# EAGLE design LEDDisplays-v00 (EAGLE 6.3)
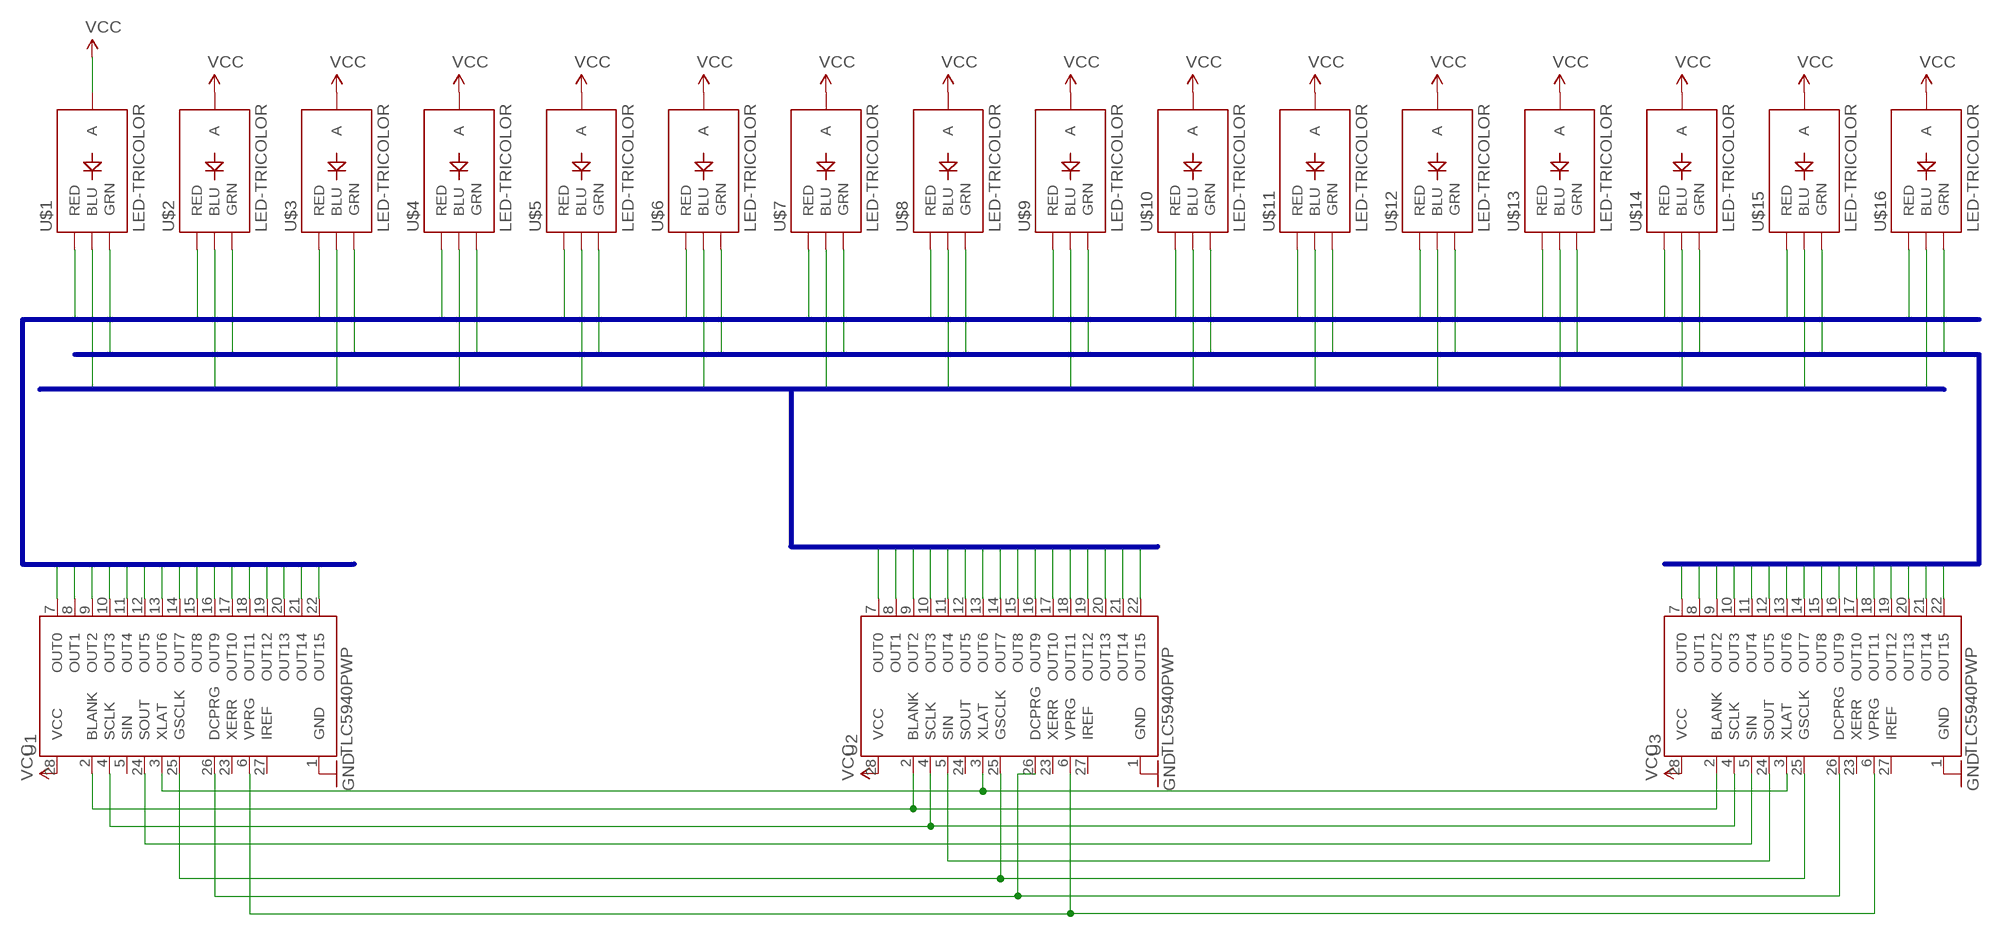
[diagram p0: schematic, sheet 1]

## Parts
U1  TLC5940PWP  [TSSOP28-GROUNDPAD]
U2  TLC5940PWP  [TSSOP28-GROUNDPAD]
U3  TLC5940PWP  [TSSOP28-GROUNDPAD]
U$1  LED-TRICOLOR  [LED-TRICOLOR-SMD]
U$2  LED-TRICOLOR  [LED-TRICOLOR-SMD]
U$3  LED-TRICOLOR  [LED-TRICOLOR-SMD]
U$4  LED-TRICOLOR  [LED-TRICOLOR-SMD]
U$5  LED-TRICOLOR  [LED-TRICOLOR-SMD]
U$6  LED-TRICOLOR  [LED-TRICOLOR-SMD]
U$7  LED-TRICOLOR  [LED-TRICOLOR-SMD]
U$8  LED-TRICOLOR  [LED-TRICOLOR-SMD]
U$9  LED-TRICOLOR  [LED-TRICOLOR-SMD]
U$10  LED-TRICOLOR  [LED-TRICOLOR-SMD]
U$11  LED-TRICOLOR  [LED-TRICOLOR-SMD]
U$12  LED-TRICOLOR  [LED-TRICOLOR-SMD]
U$13  LED-TRICOLOR  [LED-TRICOLOR-SMD]
U$14  LED-TRICOLOR  [LED-TRICOLOR-SMD]
U$15  LED-TRICOLOR  [LED-TRICOLOR-SMD]
U$16  LED-TRICOLOR  [LED-TRICOLOR-SMD]

## Nets
B1: U2.7(OUT0) U$1.B(BLU)
B2: U2.8(OUT1) U$2.B(BLU)
B3: U2.9(OUT2) U$3.B(BLU)
B4: U2.10(OUT3) U$4.B(BLU)
B5: U2.11(OUT4) U$5.B(BLU)
B6: U2.12(OUT5) U$6.B(BLU)
B7: U2.13(OUT6) U$7.B(BLU)
B8: U2.14(OUT7) U$8.B(BLU)
B9: U2.15(OUT8) U$9.B(BLU)
B10: U2.16(OUT9) U$10.B(BLU)
B11: U2.17(OUT10) U$11.B(BLU)
B12: U2.18(OUT11) U$12.B(BLU)
B13: U2.19(OUT12) U$13.B(BLU)
B14: U2.20(OUT13) U$14.B(BLU)
B15: U2.21(OUT14) U$15.B(BLU)
B16: U2.22(OUT15) U$16.B(BLU)
BLANK: U1.2(BLANK) U2.2(BLANK) U3.2(BLANK)
DCPRG: U1.26(DCPRG) U2.26(DCPRG) U3.26(DCPRG)
G1: U3.7(OUT0) U$1.G(GRN)
G2: U3.8(OUT1) U$2.G(GRN)
G3: U3.9(OUT2) U$3.G(GRN)
G4: U3.10(OUT3) U$4.G(GRN)
G5: U3.11(OUT4) U$5.G(GRN)
G6: U3.12(OUT5) U$6.G(GRN)
G7: U3.13(OUT6) U$7.G(GRN)
G8: U3.14(OUT7) U$8.G(GRN)
G9: U3.15(OUT8) U$9.G(GRN)
G10: U3.16(OUT9) U$10.G(GRN)
G11: U3.17(OUT10) U$11.G(GRN)
G12: U3.18(OUT11) U$12.G(GRN)
G13: U3.19(OUT12) U$13.G(GRN)
G14: U3.20(OUT13) U$14.G(GRN)
G15: U3.21(OUT14) U$15.G(GRN)
G16: U3.22(OUT15) U$16.G(GRN)
GND: U1.1(GND) U2.1(GND) U3.1(GND)
GSCLK: U1.25(GSCLK) U2.25(GSCLK) U3.25(GSCLK)
N$1: U1.24(SOUT) U3.5(SIN)
N$2: U2.5(SIN) U3.24(SOUT)
R1: U1.7(OUT0) U$1.R(RED)
R2: U1.8(OUT1) U$2.R(RED)
R3: U1.9(OUT2) U$3.R(RED)
R4: U1.10(OUT3) U$4.R(RED)
R5: U1.11(OUT4) U$5.R(RED)
R6: U1.12(OUT5) U$6.R(RED)
R7: U1.13(OUT6) U$7.R(RED)
R8: U1.14(OUT7) U$8.R(RED)
R9: U1.15(OUT8) U$9.R(RED)
R10: U1.16(OUT9) U$10.R(RED)
R11: U1.17(OUT10) U$11.R(RED)
R12: U1.18(OUT11) U$12.R(RED)
R13: U1.19(OUT12) U$13.R(RED)
R14: U1.20(OUT13) U$14.R(RED)
R15: U1.21(OUT14) U$15.R(RED)
R16: U1.22(OUT15) U$16.R(RED)
SCLK: U1.4(SCLK) U2.4(SCLK) U3.4(SCLK)
VCC [VCC]: U1.28(VCC) U2.28(VCC) U3.28(VCC) U$1.A U$2.A U$3.A U$4.A U$5.A U$6.A U$7.A U$8.A U$9.A U$10.A U$11.A U$12.A U$13.A U$14.A U$15.A U$16.A
VPRG: U1.6(VPRG) U2.6(VPRG) U3.6(VPRG)
XLAT: U1.3(XLAT) U2.3(XLAT) U3.3(XLAT)
Unconnected: U1.5(SIN) U1.23(XERR) U1.27(IREF) U2.23(XERR) U2.24(SOUT) U2.27(IREF) U3.23(XERR) U3.27(IREF)

## Buses
R[1..16]
G[1..16]
B[1..16]

## Library data of the parts
U1-U3 = SparkFun-DigitalIC:TLC5940: 16-channel LED Driver with Dot Correction and Grayscale PWM Control The TLC5940 is a 16-channel, constant-current sink LED driver. Each channel has an individually adjustable 4096-step grayscale PWM brightness control and a 64-step, constant-current sink (dot correction). The dot correction adjusts the brightness variations between LED channels and other LED drivers. The dot correction data is stored in an integrated EEPROM. Both grayscale control and dot correction are accessible via a serial interface. A single external resistor sets the maximum current value of all 16 channels. Packages: 28-pin HTSSOP 32-pin 5x5mm QFN 28-pin DIP
U$1-U$16 = SparkFun-LED:LED-TRICOLOR: Tri-Color LED SMD Proven layout and schematic for triple color LED in SMD package - common anode. Spark Fun Electronics SKU : COM-07844

## Net classes
0 default: width 0.152 mm
1 VCC: width 0.254 mm

## Board
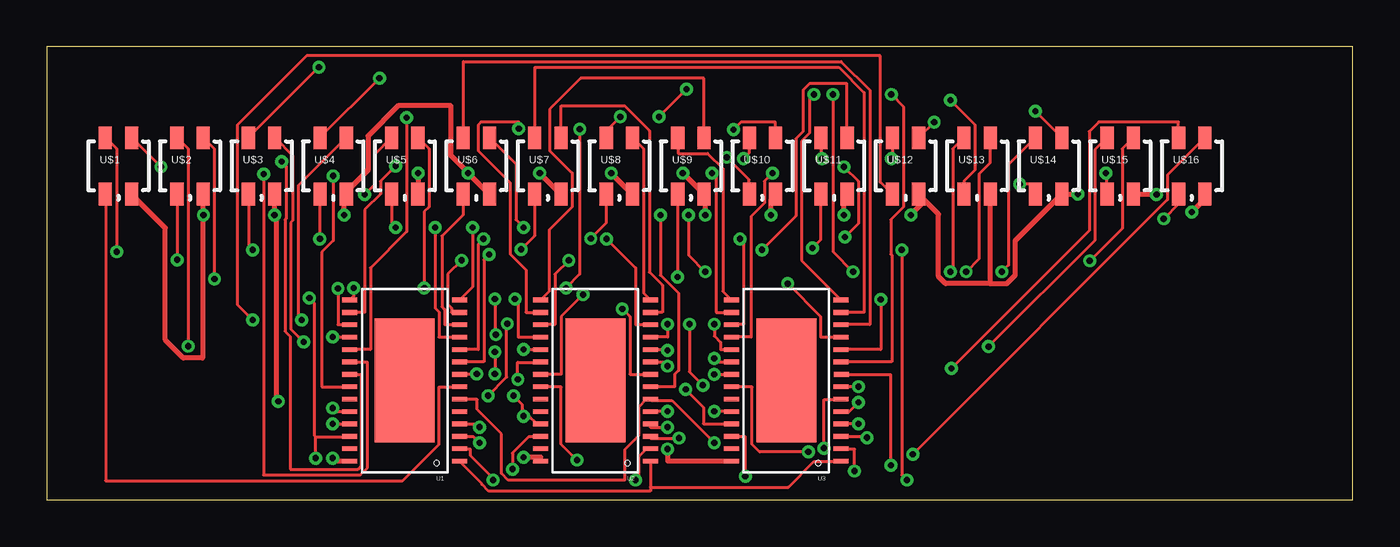
[diagram p1: board, top side]
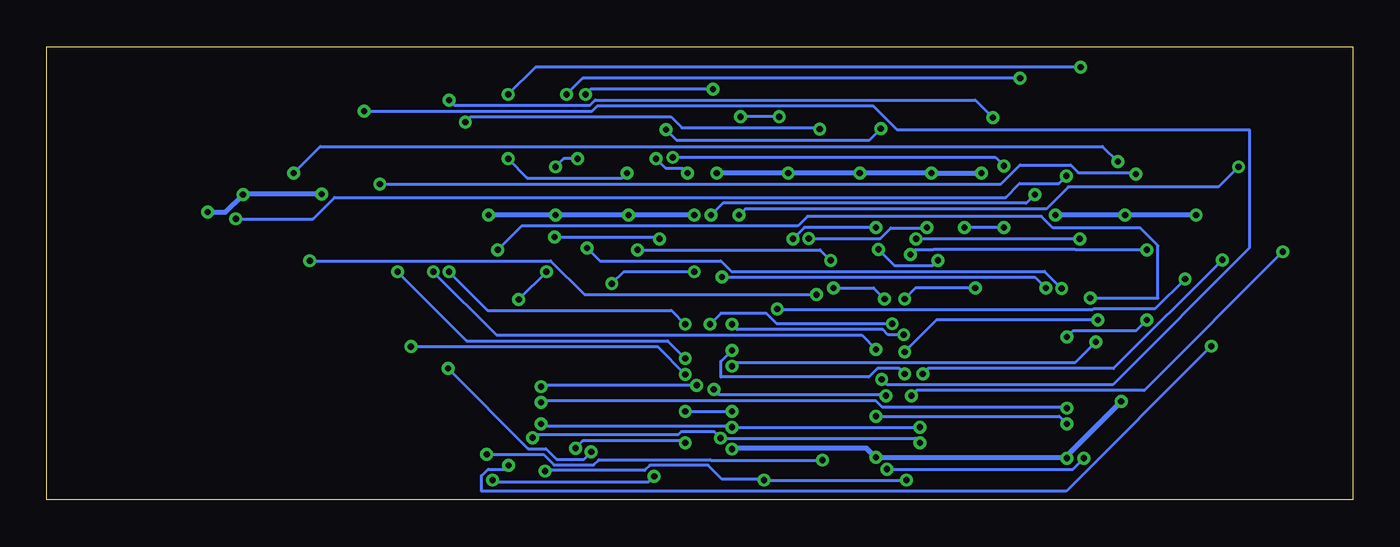
[diagram p2: board, bottom side, seen from below]

Size 69.52 x 24.12 mm. Coordinates in mm from the lower left corner, seen from the top.
Outline: 0,0 69.52,0 69.52,24.12 0,24.12 0,0
Copper layers (1*16): Top 0.0356mm / dielectric 1.5011mm / Bottom 0.0356mm
Design rules "LaenPCBOrder-JCModified": minimum track width 6mil, minimum drill 13mil, track to track 6mil, track to pad 6mil, pad to pad 6mil, via to via 6mil, smd to smd 6mil, copper to edge 15mil, drill to drill 6mil, minimum pad ring 12mil, minimum via ring 7mil, stop-mask expansion 4mil, vias tented up to drill 25mil, thermal gap 10mil

### Footprints (pad centres in the part's own frame; a part is rotated, then mirrored left to right if it is on the bottom)
TSSOP28-GROUNDPAD = smd 0.8 x 0.25: 1 -2.921,4.298; 2 -2.921,3.637; 3 -2.921,2.977; 4 -2.921,2.317; 5 -2.921,1.656; 6 -2.921,0.996; 7 -2.921,0.335; 8 -2.927,-0.325; 9 -2.921,-0.985; 10 -2.921,-1.646; 11 -2.921,-2.306; 12 -2.921,-2.967; 13 -2.921,-3.627; 14 -2.921,-4.287; 15 2.921,-4.287; 16 2.921,-3.627; 17 2.921,-2.967; 18 2.921,-2.306; 19 2.921,-1.646; 20 2.921,-0.985; 21 2.927,-0.325; 22 2.921,0.335; 23 2.921,0.996; 24 2.921,1.656; 25 2.921,2.317; 26 2.921,2.977; 27 2.921,3.637; 28 2.921,4.298 | smd 3.2 x 6.6: 29 0,0.005
LED-TRICOLOR-SMD = smd 0.7 x 1.2: A 0.7,-1.5; B 0.7,1.5; G -0.7,1.5; R -0.7,-1.5

### Placement (x,y rotation side)
U1  19.05,6.35 180 top
U2  29.21,6.35 180 top
U3  39.37,6.35 180 top
U$1  3.81,17.78 0 top
U$2  7.62,17.78 0 top
U$3  11.43,17.78 0 top
U$4  15.24,17.78 0 top
U$5  19.05,17.78 0 top
U$6  22.86,17.78 0 top
U$7  26.67,17.78 0 top
U$8  30.48,17.78 0 top
U$9  34.29,17.78 0 top
U$10  38.1,17.78 0 top
U$11  41.91,17.78 0 top
U$12  45.72,17.78 0 top
U$13  49.53,17.78 0 top
U$14  53.34,17.78 0 top
U$15  57.15,17.78 0 top
U$16  60.96,17.78 0 top

### Tracks (layer width: path | path; a pad name or v marks a point on that pad's centre or on a via)
B1  (via drill 0.33)
  Top 0.152: v32.66,15.16 32.66,11.96 33.63,11 33.63,6.88 33.43,6.68 33.43,6.02 U2.7 | v6.07,17.73 U$1.B
  Bottom 0.152: v32.66,15.16 32.33,15.49 16.31,15.49 15.14,16.66 7.14,16.66 v6.07,17.73
B2  (via drill 0.33)
  Top 0.152: v30.63,10.16 31.04,9.75 31.04,6.68 U2.8 | v8.91,11.76 8.91,18.69 U$2.B
  Bottom 0.152: v30.63,10.16 30.58,10.11 13.84,10.11 13.79,10.16 10.52,10.16 v8.91,11.76
B3  (via drill 0.33)
  Top 0.152: v33.05,7.11 33.05,7.32 32.13,7.32 U2.9 | v13.66,8.41 12.98,9.09 12.98,14.76 13.08,14.86 13.08,18.34 U$3.B
  Bottom 0.152: v33.05,7.11 32.87,7.29 14.78,7.29 v13.66,8.41
B4  (via drill 0.33)
  Top 0.152: v33.05,7.95 33.05,7.98 32.13,7.98 U2.10 | v23.85,7.87 v23.85,6.71 | v13.56,9.58 13.39,9.75 13.39,16.74 15.93,19.28 U$4.B
  Bottom 0.152: v33.05,7.95 33.63,7.37 33.63,6.53 25.76,6.53 25.3,6.99 24.13,6.99 v23.85,6.71 | v23.85,7.87 22.15,9.58 v13.56,9.58
B5  (via drill 0.33)
  Top 0.152: v33.05,9.35 33.05,8.66 U2.11 | v23.9,8.79 23.85,8.84 v23.85,10.69 | v20.09,11.28 20.09,15.34 20.34,15.6 20.34,18.69 U$5.B
  Bottom 0.152: v33.05,9.35 32.77,9.07 25.02,9.07 24.74,8.79 v23.9,8.79 | v23.85,10.69 23.27,11.28 v20.09,11.28
B6  (via drill 0.33)
  Top 0.152: v29.79,13.89 31.34,12.34 31.34,9.32 U2.12 | v25.38,14.5 24.97,14.91 24.97,17.88 23.57,19.28 U$6.B
  Bottom 0.152: v29.79,13.89 29.18,14.5 v25.38,14.5
B7
  Top 0.152: U2.13 32.77,9.98 32.77,11.43 32.08,12.12 32.08,19.66 30.76,20.98 27.38,20.98 27.38,19.3 U$7.B
B8
  Top 0.152: U2.14 31.77,11 31.77,18.69 U$8.B
B9
  Top 0.152: U2.15 26.75,11.1 26.75,14.38 27.96,15.6 27.96,17.4 26.77,18.59 26.77,20.8 28.42,22.45 34.98,22.45 34.98,19.3 U$9.B
B10  (via drill 0.33)
  Top 0.152: v25.12,19.76 25.12,20.12 23.11,20.12 22.96,19.96 22.96,18.59 24.66,16.89 24.66,13.08 25.5,12.24 25.5,9.98 U2.16 | v36.55,19.71 36.96,20.12 38.79,20.12 38.79,19.3 U$10.B
  Bottom 0.152: v25.12,19.76 25.73,19.15 35.99,19.15 v36.55,19.71
B11  (via drill 0.33)
  Top 0.152: v27.79,12.75 27.05,12.01 27.05,9.32 U2.17 | v38.08,13.31 39.88,15.11 39.88,19.23 40.26,19.61 40.26,21.82 40.62,22.17 42.6,22.17 42.6,19.3 U$11.B
  Bottom 0.152: v27.79,12.75 28.35,13.31 v38.08,13.31
B12  (via drill 0.33)
  Top 0.152: v24.92,10.69 25.09,10.52 25.09,8.66 U2.18 | v27.64,11.28 28.37,12.01 v28.37,19.74 | v47.24,20.12 46.43,19.3 U$12.B
  Bottom 0.152: v24.92,10.69 25.5,11.28 v27.64,11.28 | v28.37,19.74 28.45,19.81 35.71,19.81 36.3,20.4 46.97,20.4 v47.24,20.12
B13  (via drill 0.33)
  Top 0.152: v25.38,8 U2.19 | v48.95,12.14 49.63,12.83 49.63,17.35 50.22,17.93 50.22,19.28 U$13.B
  Bottom 0.152: v25.38,8 26.14,8.76 45.57,8.76 v48.95,12.14
B14  (via drill 0.33)
  Top 0.152: v25.07,6.4 25.07,7.32 26.29,7.32 U2.20 | v52.63,20.7 54.03,19.3 U$14.B
  Bottom 0.152: v25.07,6.4 24.79,6.12 12.78,6.12 5.49,13.41 5.49,19.71 24.26,19.71 25.53,20.98 40.21,20.98 40.49,20.7 v52.63,20.7
B15  (via drill 0.33)
  Top 0.152: v28.55,10.92 27.38,9.75 27.38,6.68 U2.21 | v55.52,12.72 57.25,14.45 57.25,18.69 57.84,19.28 U$15.B
  Bottom 0.152: v28.55,10.92 40.89,10.92 42.7,12.72 v55.52,12.72
B16  (via drill 0.33)
  Top 0.152: v28.22,2.11 27.38,2.95 27.38,5.99 26.29,5.99 U2.22 | v46.1,2.41 59.66,15.98 59.66,17.3 61.65,19.28 U$16.B
  Bottom 0.152: v28.22,2.11 34.16,2.11 34.19,2.13 40.13,2.13 40.41,1.85 42.52,1.85 43.08,2.41 v46.1,2.41
BLANK  (via drill 0.33)
  Top 0.152: v23.75,1.04 23.75,1.14 22.55,2.34 22.55,2.69 21.97,2.69 U1.2 | v31.34,1.04 31.5,1.19 31.5,2.29 31.9,2.69 32.13,2.69 U2.2 | v43,1.52 43,2.69 42.29,2.69 U3.2
  Bottom 0.152: v23.75,1.04 v31.34,1.04 31.39,1.09 33.58,1.09 34.31,1.83 37.41,1.83 37.69,1.55 42.98,1.55 v43,1.52
DCPRG  (via drill 0.33)
  Top 0.152: 14.3,3.35 16.13,3.35 U1.26 | v14.3,2.21 14.3,3.35 | v24.79,1.63 24.79,2.49 25.65,3.35 26.29,3.35 U2.26 | v37.19,1.25 37.19,3.35 36.45,3.35 U3.26 | v45.8,1.04 45.52,1.32 v45.52,13.31 | v13.97,10.74 14.25,10.46 14.25,3.4 14.3,3.35
  Bottom 0.152: v14.3,2.21 14.88,1.63 v24.79,1.63 | v37.19,1.25 37.49,0.94 45.7,0.94 v45.8,1.04 | v45.52,13.31 44.25,14.58 29.54,14.58 29.03,15.09 16.56,15.09 15.95,14.48 11.3,14.48 10.36,13.54 10.36,10.74 v13.97,10.74
G1  (via drill 0.33)
  Top 0.152: v43.2,6.02 U3.7 | v34.92,6.1 34.21,6.81 v34.21,9.35 | v24.51,9.37 24.49,9.35 24.49,6.53 v23.5,5.54 | v3.71,13.21 3.71,18.69 3.12,19.28 U$1.G
  Bottom 0.152: v43.2,6.02 43.13,6.1 v34.92,6.1 | v34.21,9.35 33.63,9.93 31.22,9.93 30.66,9.37 v24.51,9.37 | v23.5,5.54 23.22,5.82 11.1,5.82 v3.71,13.21
G2  (via drill 0.33)
  Top 0.152: v44.93,1.83 44.93,6.66 42.32,6.66 U3.8 | v7.52,8.18 7.52,18.69 6.93,19.28 U$2.G
  Bottom 0.152: v44.93,1.83 45.14,1.63 46.02,1.63 46.38,1.27 46.38,0.46 15.24,0.46 v7.52,8.18
G3  (via drill 0.33)
  Top 0.152: v44.96,21.59 45.62,20.93 45.62,15.6 44.93,14.91 44.93,13.08 44.98,13.03 44.98,7.34 U3.9 | v14.48,23.04 10.74,19.3 U$3.G
  Bottom 0.152: v44.96,21.59 43.51,23.04 v14.48,23.04
G4  (via drill 0.33)
  Top 0.152: v44.4,10.67 44.4,8 U3.10 | v42.93,12.14 41.86,13.21 v41.86,21.59 | v17.7,22.45 14.55,19.3 U$4.G
  Bottom 0.152: v42.93,12.14 v44.4,10.67 | v41.86,21.59 41,22.45 v17.7,22.45
G5  (via drill 0.33)
  Top 0.152: v39.45,11.51 41.2,9.75 41.2,8.66 U3.11 | v35.05,12.14 34.16,13.03 v34.16,15.16 | v16.92,16.26 17.45,16.79 17.45,18.39 18.34,19.28 U$5.G
  Bottom 0.152: v39.45,11.51 38.81,12.14 v35.05,12.14 | v34.16,15.16 33.53,15.8 17.37,15.8 v16.92,16.26
G6
  Top 0.152: U3.12 43.81,9.32 43.81,21.82 42.29,23.34 22.17,23.34 22.17,19.3 U$6.G
G7
  Top 0.152: U3.13 43.51,9.98 43.51,21.69 42.16,23.04 25.98,23.04 25.98,19.3 U$7.G
G8  (via drill 0.33)
  Top 0.152: v40.84,21.59 40.62,21.36 40.62,19.53 40.18,19.1 40.18,12.75 U3.14 | v32.59,20.4 v34.06,21.87 | v30.53,20.4 29.79,19.66 29.79,19.3 U$8.G
  Bottom 0.152: v40.84,21.59 40.56,21.87 v34.06,21.87 | v30.53,20.4 v32.59,20.4
G9
  Top 0.152: U3.15 35.99,11.1 35.99,17.63 35.18,18.44 33.6,18.44 33.6,19.28 U$9.G
G10  (via drill 0.33)
  Top 0.152: v35.41,17.4 35.64,17.17 35.64,9.98 U3.16 | v37.08,18.16 37.39,18.47 U$10.G
  Bottom 0.152: v35.41,17.4 35.66,17.65 36.58,17.65 v37.08,18.16
G11  (via drill 0.33)
  Top 0.152: v36.91,13.89 37.08,13.72 37.08,9.32 U3.17 | v42.49,13.99 43.2,14.71 43.2,16.97 v42.44,17.73 | v41.27,18.16 41.22,18.21 41.22,19.28 U$11.G
  Bottom 0.152: v36.91,13.89 37.01,13.99 v42.49,13.99 | v42.44,17.73 42.01,18.16 v41.27,18.16
G12  (via drill 0.33)
  Top 0.152: v38.63,17.4 38.2,16.97 38.2,15.8 37.49,15.09 37.49,8.66 U3.18 | v44.96,18.16 45.01,18.21 U$12.G
  Bottom 0.152: v38.63,17.4 38.89,17.14 43.94,17.14 v44.96,18.16
G13  (via drill 0.33)
  Top 0.152: v35.53,9.35 35.53,8.71 35.87,8.38 35.87,8 U3.19 | v48.11,12.14 48.23,12.27 48.23,18.69 U$13.G
  Bottom 0.152: v35.53,9.35 36.27,10.08 46.05,10.08 v48.11,12.14
G14  (via drill 0.33)
  Top 0.152: v35.53,7.52 35.53,7.34 U3.20 | v50.85,12.14 51.21,12.5 51.21,17.86 52.63,19.28 U$14.G
  Bottom 0.152: v35.53,7.52 36.47,8.46 47.17,8.46 v50.85,12.14
G15  (via drill 0.33)
  Top 0.152: v35.53,6.68 36.42,6.68 U3.21 | v50.14,8.15 55.8,13.82 55.8,18.64 U$15.G
  Bottom 0.152: v35.53,6.68 37.01,8.15 v50.14,8.15
G16  (via drill 0.33)
  Top 0.152: v40.54,2.54 37.95,2.54 37.54,2.95 37.54,5.99 36.45,5.99 U3.22 | v48.16,6.99 55.5,14.33 55.5,19.61 56.01,20.12 60.25,20.12 60.25,19.3 U$16.G
  Bottom 0.152: v40.54,2.54 40.92,2.16 42.39,2.16 42.95,2.72 43.89,2.72 v48.16,6.99
GND
  Top 0.152: U2.1 32.13,0.66 | 32.13,0.66 32.13,0.46 23.52,0.46 23.16,0.81 23.16,0.84 21.97,2.03 U1.1 | 32.13,0.66 39.47,0.66 40.84,2.03 42.29,2.03 U3.1
GSCLK  (via drill 0.33)
  Top 0.152: v15.21,4.04 U1.25 | U2.25 26.09,4.04 25.68,4.45 v25.38,4.45 25.32,4.5 25.32,5.05 v24.84,5.54 | v34.01,5.87 34.95,4.93 34.95,4.04 U3.25
  Bottom 0.152: v15.21,4.04 15.62,4.45 v25.38,4.45 | v34.01,5.87 33.73,5.59 24.89,5.59 v24.84,5.54
N$1  (via drill 0.33)
  Top 0.152: v15.21,4.88 15.21,4.7 U1.24 | v43.2,5.18 42.72,4.7 U3.5
  Bottom 0.152: v15.21,4.88 15.29,4.95 25.07,4.95 25.4,5.28 43.1,5.28 v43.2,5.18
N$2  (via drill 0.33)
  Top 0.152: v33.05,4.7 U2.5 | v35.53,4.7 U3.24
  Bottom 0.152: v35.53,4.7 v33.05,4.7
R1
  Top 0.152: U1.7 21.97,5.99 20.88,5.99 20.88,2.95 18.95,1.02 3.12,1.02 3.12,16.26 U$1.R
R2  (via drill 0.33)
  Top 0.152: v22.89,6.71 22.89,6.68 22,6.68 U1.8 | v6.93,12.78 6.93,16.26 U$2.R
  Bottom 0.152: v22.89,6.71 22.61,6.99 12.72,6.99 v6.93,12.78
R3  (via drill 0.33)
  Top 0.152: v23.55,13.06 23.27,12.78 23.27,7.34 U1.9 | v10.95,13.31 10.74,13.51 10.74,16.26 U$3.R
  Bottom 0.152: v23.55,13.06 23.29,13.31 22.33,13.31 22.3,13.34 14.78,13.34 14.76,13.31 v10.95,13.31
R4  (via drill 0.33)
  Top 0.152: v23.24,13.89 22.96,13.61 22.96,8 U1.10 | v14.53,13.89 14.53,16.26 U$4.R
  Bottom 0.152: v14.53,13.89 v23.24,13.89
R5  (via drill 0.33)
  Top 0.152: v20.68,14.5 20.68,10.21 20.88,10.01 20.88,8.66 U1.11 | v18.57,14.5 18.36,14.71 18.36,16.26 U$5.R
  Bottom 0.152: v18.57,14.5 v20.68,14.5
R6
  Top 0.152: U1.12 21.18,9.32 21.18,10.13 21.03,10.29 21.03,14.05 22.15,15.16 22.15,16.26 U$6.R
R7  (via drill 0.33)
  Top 0.152: v22.07,12.75 21.34,12.01 21.34,10.41 21.54,10.21 21.54,9.98 U1.13 | v25.25,13.34 25.96,14.05 25.96,16.26 U$7.R
  Bottom 0.152: v22.07,12.75 22.35,12.47 24.38,12.47 v25.25,13.34
R8  (via drill 0.33)
  Top 0.152: v22.66,14.5 22.66,11.33 U1.14 | v28.96,13.92 29.77,14.73 29.77,16.26 U$8.R
  Bottom 0.152: v22.66,14.5 22.68,14.48 24.59,14.48 25.15,13.92 v28.96,13.92
R9  (via drill 0.33)
  Top 0.152: v16.33,11.28 16.33,10.85 U1.15 | v33.58,11.86 33.58,16.26 U$9.R
  Bottom 0.152: v16.33,11.28 16.92,11.86 v33.58,11.86
R10  (via drill 0.33)
  Top 0.152: v18.57,17.78 17.75,16.97 17.75,16.28 16.92,15.44 16.92,9.98 U1.16 | v36.2,18.24 37.39,17.04 U$10.R
  Bottom 0.152: v18.57,17.78 19.02,18.24 v36.2,18.24
R11  (via drill 0.33)
  Top 0.152: v15.49,11.25 15.49,9.32 U1.17 | v40.77,13.41 41.2,13.84 41.2,16.26 U$11.R
  Bottom 0.152: v15.49,11.25 16.41,12.17 33.07,12.17 33.63,12.72 40.08,12.72 v40.77,13.41
R12  (via drill 0.33)
  Top 0.152: v15.21,8.66 U1.18 | v10.95,9.58 10.13,10.39 10.13,19.96 13.82,23.65 44.37,23.65 44.37,16.92 U$12.R
  Bottom 0.152: v15.21,8.66 14.88,8.99 11.53,8.99 v10.95,9.58
R13  (via drill 0.33)
  Top 0.152: v19.15,20.34 19.15,14.28 17.22,12.34 17.22,8 U1.19 | v48.11,21.29 49.43,19.96 49.43,17.58 48.84,16.99 48.84,16.28 U$13.R
  Bottom 0.152: v19.15,20.34 20.09,21.29 40.34,21.29 40.62,21.01 47.83,21.01 v48.11,21.29
R14  (via drill 0.33)
  Top 0.152: v11.53,17.35 11.53,1.32 16.69,1.32 17.07,1.7 17.07,7.32 16.13,7.32 U1.20 | v51.79,16.82 52.63,16.82 52.63,16.28 U$14.R
  Bottom 0.152: v11.53,17.35 11.61,17.42 14.61,17.42 15.01,17.83 17.7,17.83 18.72,16.82 v51.79,16.82
R15  (via drill 0.33)
  Top 0.152: v12.5,18.01 12.72,17.78 12.72,14.96 12.68,14.91 12.68,8.97 12.95,8.69 12.95,1.63 16.56,1.63 16.76,1.83 16.76,6.66 16.13,6.66 U1.21 | v56.39,17.4 56.44,17.35 U$15.R
  Bottom 0.152: v12.5,18.01 13.31,18.82 54.97,18.82 v56.39,17.4
R16  (via drill 0.33)
  Top 0.152: v15.24,17.25 15.24,13.79 14.63,13.18 14.63,6.02 U1.22 | v59.46,14.96 60.25,15.75 60.25,16.26 U$16.R
  Bottom 0.152: v15.24,17.25 15.65,16.84 17.73,16.84 18.47,16.1 54.2,16.1 55.35,14.96 v59.46,14.96
SCLK  (via drill 0.33)
  Top 0.152: v23.04,3.86 23.04,4.01 21.97,4.01 U1.4 | v33.05,3.86 32.13,3.86 U2.4 | v43.2,4.04 U3.4
  Bottom 0.152: v23.04,3.86 v33.05,3.86 33.1,3.91 43.08,3.91 v43.2,4.04
VCC  (via drill 0.33)
  Top 0.254: v15.21,2.21 15.21,2.06 U1.28 | v25.38,2.26 26.29,2.26 U2.28 | v33.05,2.69 33.05,2.06 U3.28 | 8.28,15.16 8.28,16.23 8.31,16.26 U$2.A | 8.28,15.16 8.28,7.54 7.26,7.54 6.3,8.51 6.3,14.48 4.52,16.26 U$1.A | U$3.A 12.12,16.26 v12.12,15.16 12.19,15.06 12.19,5.36 v12.32,5.23 | v8.33,15.16 8.28,15.16 | v15.82,15.16 15.82,16.15 15.93,16.26 U$4.A 15.95,16.41 17.09,17.55 17.09,19.38 18.69,20.98 21.51,20.98 21.51,18.34 22.35,17.5 v22.43,17.4 23.55,16.28 U$6.A | v59.08,16.26 57.86,16.26 U$15.A | v60.96,15.32 61.65,16 61.65,16.26 U$16.A | 50.22,11.51 47.85,11.51 47.47,11.89 47.47,15.21 46.43,16.26 U$12.A 46.66,15.85 46,15.19 v46,15.16 | 50.22,11.51 50.22,16.26 U$13.A | 50.22,11.51 51.1,11.51 51.56,11.96 51.56,13.79 54.03,16.26 U$14.A 54.15,16.28 v54.89,16.28 | v19.76,17.4 U$5.A | v26.24,17.4 27.36,16.28 U$7.A | v30.05,17.4 31.17,16.28 U$8.A | v33.86,17.4 34.98,16.28 U$9.A 35.03,16.15 35.03,15.19 v35.05,15.16 | v38.56,15.16 38.56,16.03 38.79,16.26 U$10.A | v42.44,15.16 42.44,16.1 42.6,16.26 U$11.A
  Bottom 0.254: v33.05,2.69 32.99,2.74 25.88,2.74 25.48,2.34 v25.38,2.26 15.27,2.26 v15.21,2.21 15.19,2.36 v12.32,5.23 | v8.33,15.16 v12.12,15.16 v15.82,15.16 | v60.96,15.32 60.02,15.32 v59.08,16.26 58.98,16.28 v54.89,16.28 | v19.76,17.4 v22.43,17.4 v26.24,17.4 v30.05,17.4 v33.86,17.4 | v35.05,15.16 v38.56,15.16 v42.44,15.16 v46,15.16
VPRG  (via drill 0.33)
  Top 0.152: U1.6 21.97,5.33 22.91,5.33 22.91,4.8 24.21,3.5 24.21,1.4 24.56,1.04 30.76,1.04 30.76,2.67 31.5,3.4 31.5,4.93 31.9,5.33 32.13,5.33 U2.6 32.18,5.28 33.27,5.28 v35.53,3.02 | v41.38,2.74 41.38,5.33 42.29,5.33 U3.6
  Bottom 0.152: v41.38,2.74 41,3.12 35.64,3.12 v35.53,3.02
XLAT  (via drill 0.33)
  Top 0.152: v23.04,3.02 22.71,3.35 21.97,3.35 U1.3 | v33.66,3.28 32.13,3.28 U2.3 | v43.66,3.3 43.66,3.35 42.29,3.35 U3.3
  Bottom 0.152: v23.04,3.02 23.29,3.28 v33.66,3.28 33.98,3.61 35.76,3.61 35.92,3.45 43.51,3.45 v43.66,3.3